# Altium schematic sheet STM32_BalanceCar.SchDoc
size A2
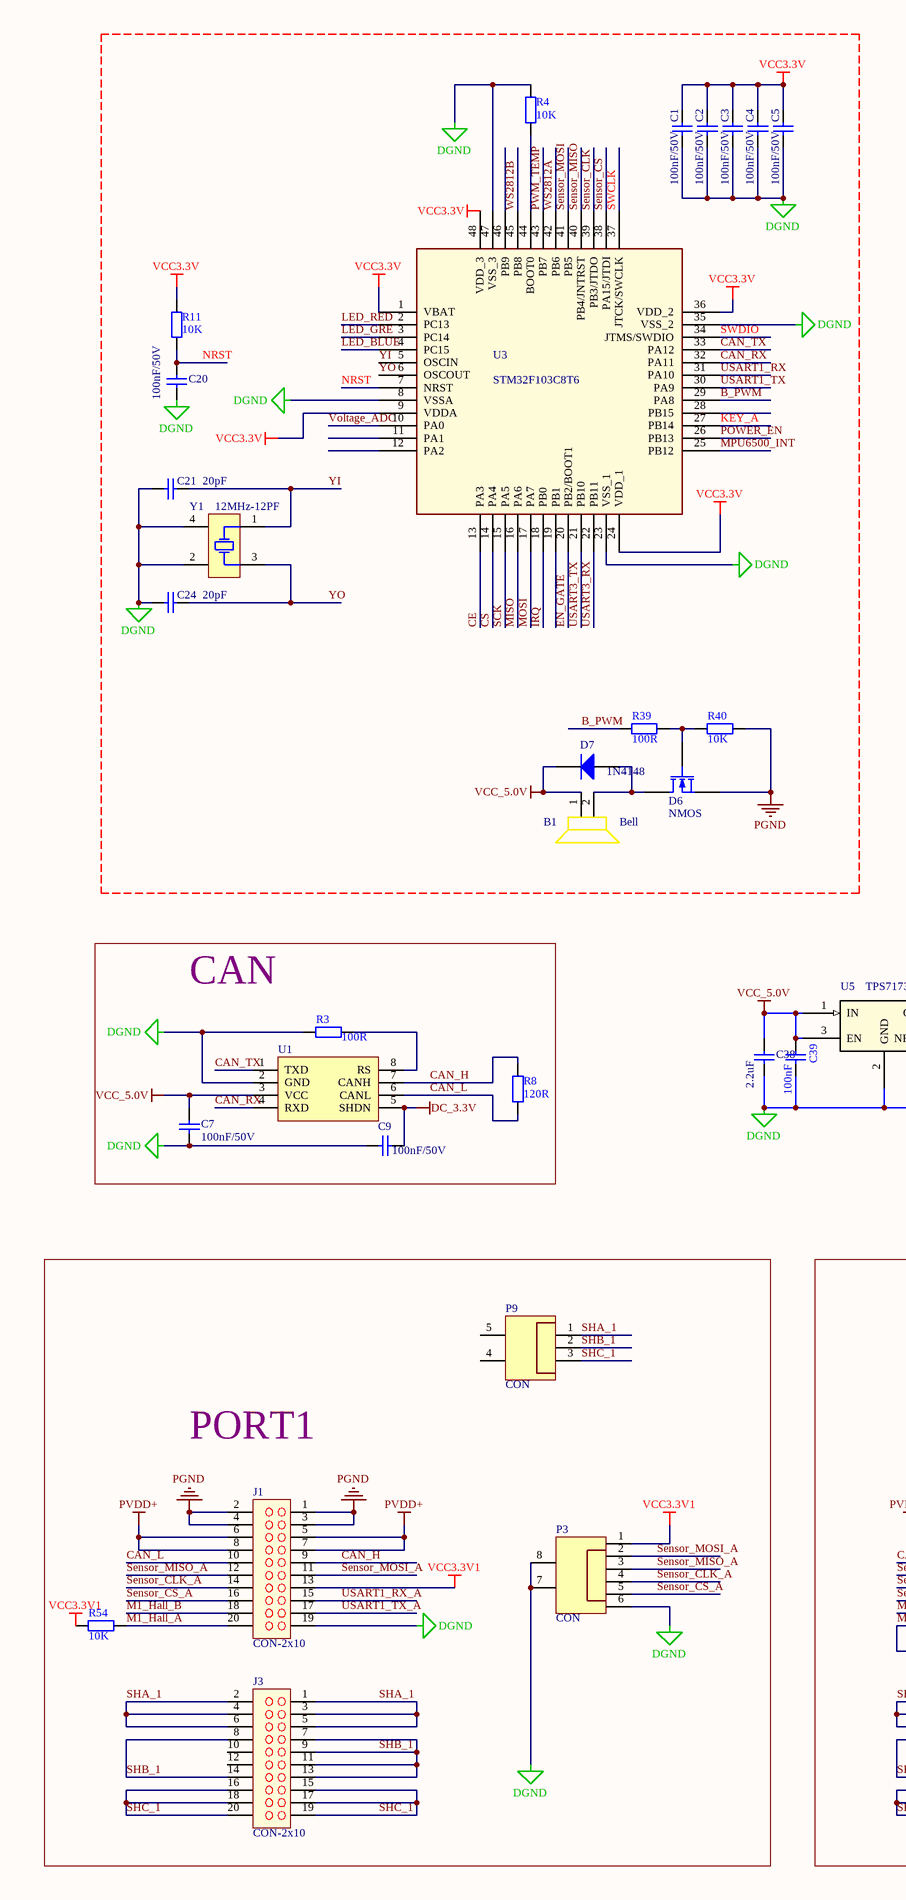
[diagram p0: STM32_BalanceCar.SchDoc, left]
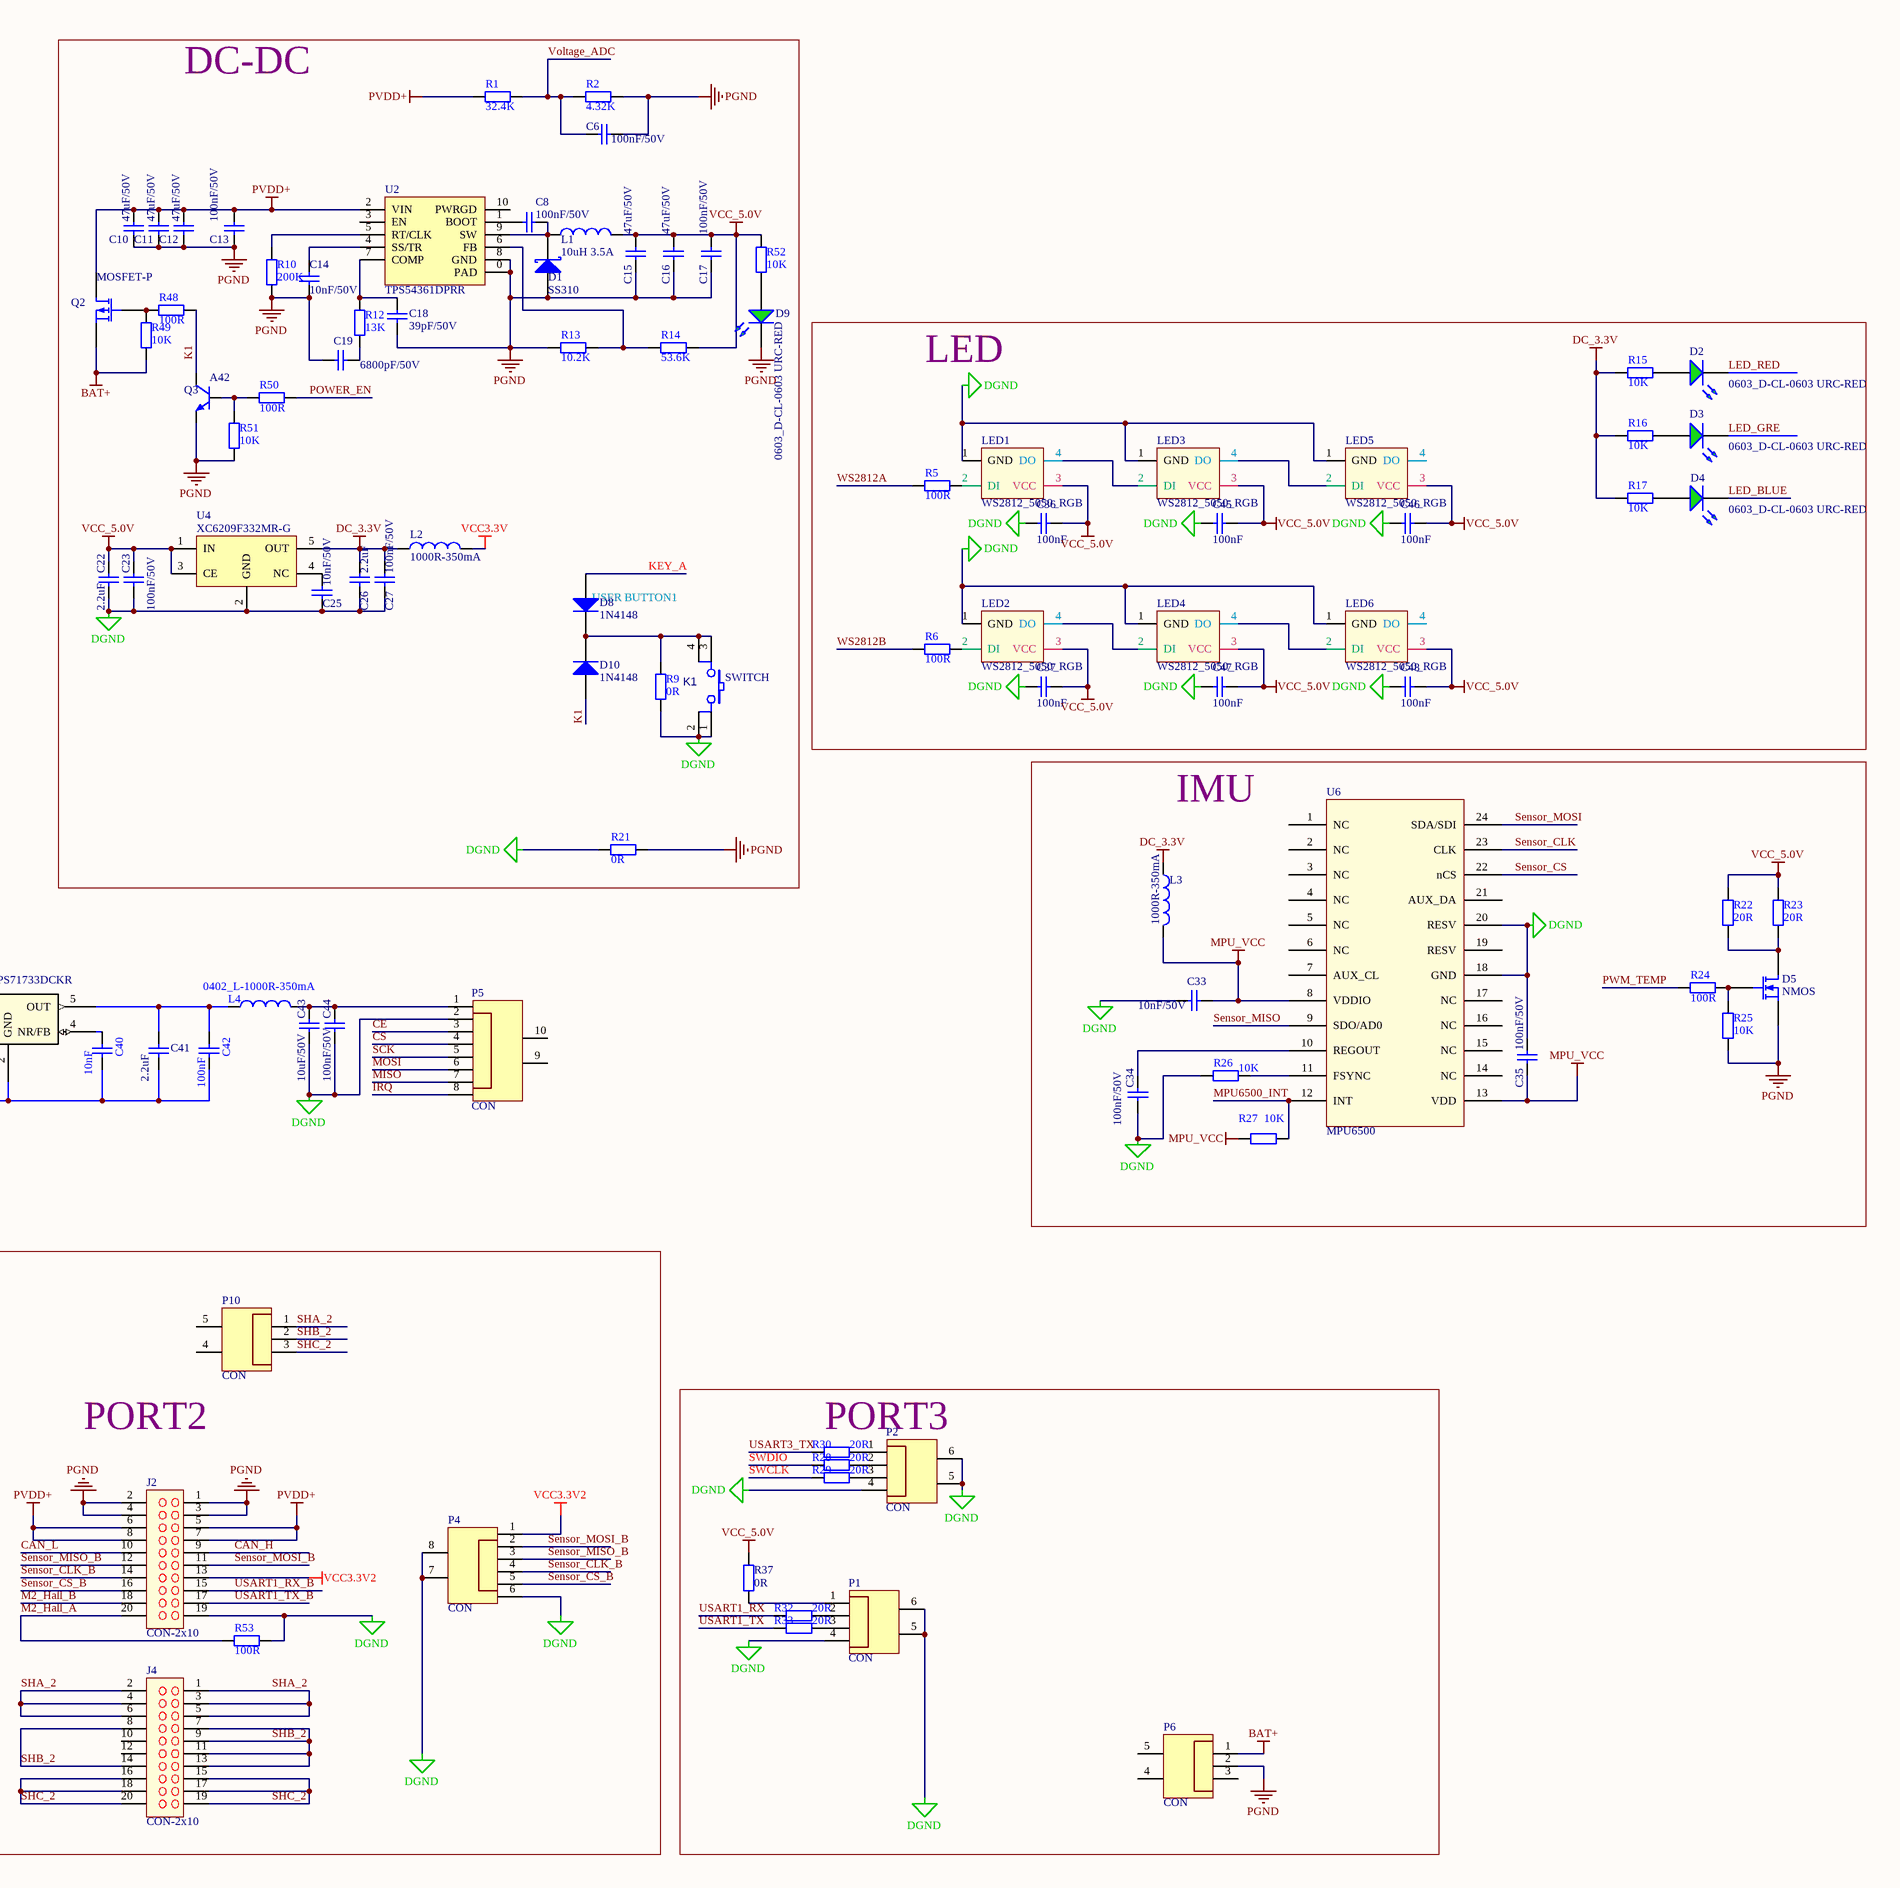
[diagram p1: STM32_BalanceCar.SchDoc, right]

## Parts
B1  Bell  [Bell]
C1  100nF/50V  [0402_C]
C2  100nF/50V  [0402_C]
C3  100nF/50V  [0402_C]
C4  100nF/50V  [0402_C]
C5  100nF/50V  [0402_C]
C6  100nF/50V  [0402_C]
C7  100nF/50V  [0402_C]
C8  100nF/50V  [0402_C]
C9  100nF/50V  [0402_C]
C10  47uF/50V  [1210_C]
C11  47uF/50V  [1210_C]
C12  47uF/50V  [1210_C]
C13  100nF/50V  [0402_C]
C14  10nF/50V  [0402_C]
C15  47uF/50V  [1206_C]
C16  47uF/50V  [1206_C]
C17  100nF/50V  [0402_C]
C18  39pF/50V  [0402_C]
C19  6800pF/50V  [0402_C]
C20  100nF/50V  [0402_C]
C21  20pF  [0402_C]
C22  2.2uF  [0402_C]
C23  100nF/50V  [0402_C]
C24  20pF  [0402_C]
C25  10nF/50V  [0402_C]
C26  2.2uF  [0402_C]
C27  100nF/50V  [0402_C]
C33  10nF/50V  [0402_C]
C34  100nF/50V  [0402_C]
C35  100nF/50V  [0402_C]
C36  100nF  [0402_C]
C37  100nF  [0402_C]
C38  2.2uF  [0603_C]
C39  100nF  [0402_C]
C40  10nF  [0402_C]
C41  2.2uF  [0603_C]
C42  100nF  [0402_C]
C43  10uF/50V  [0603_C]
C44  100nF/50V  [0603_C]
C45  100nF  [0402_C]
C46  100nF  [0402_C]
C47  100nF  [0402_C]
C48  100nF  [0402_C]
D1  SS310  [DO-214-AC(SMA)]
D2  0603_D-CL-0603 URC-RED  [0603_D]
D3  0603_D-CL-0603 URC-RED  [0603_D]
D4  0603_D-CL-0603 URC-RED  [0603_D]
D5  NMOS  [SOT23-3]
D6  NMOS  [SOT23-3]
D7  1N4148  [SOD-123]
D8  1N4148  [SOD-123]
D9  0603_D-CL-0603 URC-RED  [0603_D]
D10  1N4148  [SOD-123]
J1  CON-2x10  [CON-2x10]
J2  CON-2x10  [CON-2x10]
J3  CON-2x10  [CON-2x10]
J4  CON-2x10  [CON-2x10]
K1  value SWITCH  [SW_3x4x2.5]  (hidden comment: SW-PUSH-CMS)
L1  10uH 3.5A  [TMPC0603H]
L2  1000R-350mA  [0402_L]
L3  1000R-350mA  [0402_L]
L4  0402_L-1000R-350mA  [0402_L]
LED1  WS2812_5050_RGB  [RGB_50X50]
LED2  WS2812_5050_RGB  [RGB_50X50]
LED3  WS2812_5050_RGB  [RGB_50X50]
LED4  WS2812_5050_RGB  [RGB_50X50]
LED5  WS2812_5050_RGB  [RGB_50X50]
LED6  WS2812_5050_RGB  [RGB_50X50]
P1  CON  [BM04B-GHS-TBT(TOP)]
P2  CON  [BM04B-GHS-TBT(TOP)]
P3  CON  [BM06B-GHS-TBT(TOP)]
P4  CON  [BM06B-GHS-TBT(TOP)]
P5  CON  [NRF24L01_L]
P6  CON  [XT30U-F]
P9  CON  [MR30PW-FB]
P10  CON  [MR30PW-FB]
Q2  MOSFET-P  [DFN5X6]
Q3  A42  [SOT23-3]
R1  32.4K  [0402_R]
R2  4.32K  [0402_R]
R3  100R  [0402_R]
R4  10K  [0402_R]
R5  100R  [0402_R]
R6  100R  [0402_R]
R8  120R  [0603_R]
R9  0R  [0402_R]
R10  200K  [0402_R]
R11  10K  [0402_R]
R12  13K  [0402_R]
R13  10.2K  [0402_R]
R14  53.6K  [0402_R]
R15  10K  [0402_R]
R16  10K  [0402_R]
R17  10K  [0402_R]
R21  0R  [0805_R]
R22  20R  [0805_R]
R23  20R  [0805_R]
R24  100R  [0402_R]
R25  10K  [0402_R]
R26  10K  [0402_R]
R27  10K  [0402_R]
R28  20R  [0402_R]
R29  20R  [0402_R]
R30  20R  [0402_R]
R32  20R  [0402_R]
R33  20R  [0402_R]
R37  0R  [0603_R]
R39  100R  [0402_R]
R40  10K  [0402_R]
R48  100R  [0402_R]
R49  10K  [0402_R]
R50  100R  [0402_R]
R51  10K  [0402_R]
R52  10K  [0402_R]
R53  100R  [0402_R]
R54  10K  [0402_R]
U1  1042  [SOP-8]  (value not drawn)
U2  TPS54361DPRR  [TPS54361]
U3  STM32F103C8T6  [LQFP-48]
U4  XC6209F332MR-G  [SOT23-5]
U5  TPS71733DCKR  [SOT23-5]
U6  MPU6500  [MPU6500]
Y1  12MHz-12PF  [XTAL_SMD_3.2X2.5_4P]

## Blocks framed on the sheet
DC-DC: C6 C8 C10-C19 C22 C23 C25-C27 D1 D8-D10 K1 L1 L2 Q2 Q3 R1 R2 R9 R10 R12-R14 R21 R48-R52 U2 U4
LED: C36 C37 C45-C48 D2-D4 LED1-LED6 R5 R6 R15-R17
IMU: C33-C35 D5 L3 R22-R27 U6
CAN: C7 C9 R3 R8 U1
PORT1: J1 J3 P3 P9 R54
PORT2: J2 J4 P4 P10 R53
PORT3: P1 P2 P6 R28-R30 R32 R33 R37

## Nets
BAT+: P6.1 Q2.3(S) R49.2
DC_3.3V: C9.2 C26.1 C27.1 L2.1 L3.1 R15.2 R16.2 R17.2 U1.5(SHDN) U4.5(OUT)
DGND: C1.2 C2.2 C3.2 C4.2 C5.1 C7.2 C9.1 C20.2 C21.2 C22.2 C23.2 C24.2 C25.1 C26.2 C27.2 C33.2 C34.1 C35.2 C36.1 C37.1 C38.1 C39.1 C40.1 C41.1 C42.1 C43.1 C44.1 C45.1 C46.1 C47.2 C48.1 J1.19 J2.19 K1.1 K1.2 LED1.1(GND) LED2.1(GND) LED3.1(GND) LED4.1(GND) LED5.1(GND) LED6.1(GND) P1.4 P1.5 P1.6 P2.4 P2.5 P2.6 P3.6 P3.7 P3.8 P4.6 P4.7 P4.8 P5.2 R3.2 R4.1 R9.2 R21.1 R26.1 R53.1 U1.2(GND) U3.8(VSSA) U3.23(VSS_1) U3.35(VSS_2) U3.47(VSS_3) U4.2(GND) U5.2(GND) U6.18(GND) U6.20(RESV) Y1.2 Y1.4
MPU_VCC: C33.1 C35.1 L3.2 R27.1 U6.8(VDDIO) U6.13(VDD)
PGND: C6.1 C10.1 C11.1 C12.1 C13.1 C14.1 C15.1 C16.1 C17.1 C18.1 C19.1 D1.1(A) D5.2(D) D6.2(D) D9.2(K) J1.1 J1.2 J1.3 J1.4 J2.1 J2.2 J2.3 J2.4 P6.2 Q3.2(E) R2.2 R10.2 R13.1 R21.2 R25.1 R40.2 R51.2 U2.0(PAD) U2.8(GND)
PVDD+: C10.2 C11.2 C12.2 C13.2 J1.5 J1.6 J1.7 J1.8 J2.5 J2.6 J2.7 J2.8 Q2.2(D) R1.1 U2.2(VIN)
VCC3.3V: C1.1 C2.1 C3.1 C4.1 C5.2 L2.2 R11.1 U3.1(VBAT) U3.9(VDDA) U3.24(VDD_1) U3.36(VDD_2) U3.48(VDD_3)
VCC3.3V1: J1.13 P3.1 R54.1
VCC3.3V2: J2.13 P4.1
VCC_5.0V: B1.1(+) C7.1 C15.2 C16.2 C17.2 C22.1 C23.1 C36.2 C37.2 C38.2 C39.2 C45.2 C46.2 C47.1 C48.2 D7.2(K) L1.2 LED1.3(VCC) LED2.3(VCC) LED3.3(VCC) LED4.3(VCC) LED5.3(VCC) LED6.3(VCC) R14.2 R22.2 R23.2 R37.2 R52.1 U1.3(VCC) U4.1(IN) U4.3(CE) U5.1(IN) U5.3(EN)
B_PWM: R39.2 U3.29(PA8)
CAN_H: J1.9 J2.9 R8.1 U1.7(CANH)
CAN_L: J1.10 J2.10 R8.2 U1.6(CANL)
CAN_RX: U1.4(RXD) U3.32(PA11)
CAN_TX: U1.1(TXD) U3.33(PA12)
CE: P5.3 U3.13(PA3)
CS: P5.4 U3.14(PA4)
EN_GATE: U3.20(PB2/BOOT1)
IRQ: P5.8 U3.18(PB0)
K1: D10.1(A) Q3.3(C) R48.1
KEY_A: D8.1(A) U3.27(PB14)
LED_BLUE: D4.2(K) U3.4(PC15)
LED_GRE: D3.2(K) U3.3(PC14)
LED_RED: D2.2(K) U3.2(PC13)
M1_Hall_A: J1.20 R54.2
M1_Hall_B: J1.18
M2_Hall_A: J2.20 R53.2
M2_Hall_B: J2.18
MISO: P5.7 U3.16(PA6)
MOSI: P5.6 U3.17(PA7)
MPU6500_INT: R27.2 U3.25(PB12) U6.12(INT)
NRST: C20.1 R11.2 U3.7(NRST)
POWER_EN: R50.1 U3.26(PB13)
PWM_TEMP: R24.2 U3.43(PB7)
SCK: P5.5 U3.15(PA5)
Sensor_CLK: U3.39(PB3/JTDO) U6.23(CLK)
Sensor_CLK_A: J1.14 P3.4
Sensor_CLK_B: J2.14 P4.4
Sensor_CS: U3.38(PA15/JTDI) U6.22(nCS)
Sensor_CS_A: J1.16 P3.5
Sensor_CS_B: J2.16 P4.5
Sensor_MISO: U3.40(PB4/JNTRST) U6.9(SDO/AD0)
Sensor_MISO_A: J1.12 P3.3
Sensor_MISO_B: J2.12 P4.3
Sensor_MOSI: U3.41(PB5) U6.24(SDA/SDI)
Sensor_MOSI_A: J1.11 P3.2
Sensor_MOSI_B: J2.11 P4.2
SHA_1: J3.1 J3.2 J3.3 J3.4 J3.5 J3.6 P9.1
SHA_2: J4.1 J4.2 J4.3 J4.4 J4.5 J4.6 P10.1
SHB_1: J3.7 J3.8 J3.9 J3.11 J3.13 J3.14 P9.2
SHB_2: J4.7 J4.8 J4.9 J4.11 J4.13 J4.14 P10.2
SHC_1: J3.15 J3.16 J3.17 J3.18 J3.19 J3.20 P9.3
SHC_2: J4.15 J4.16 J4.17 J4.18 J4.19 J4.20 P10.3
SWCLK: R29.1 U3.37(JTCK/SWCLK)
SWDIO: R28.1 U3.34(JTMS/SWDIO)
USART1_RX: R32.1 U3.31(PA10)
USART1_RX_A: J1.15
USART1_RX_B: J2.15
USART1_TX: R33.1 U3.30(PA9)
USART1_TX_A: J1.17
USART1_TX_B: J2.17
USART3_RX: U3.22(PB11)
USART3_TX: R30.2 U3.21(PB10)
Voltage_ADC: C6.2 R1.2 R2.1 U3.10(PA0)
WS2812A: R5.1 U3.42(PB6)
WS2812B: R6.2 U3.45(PB8)
YI: C21.1 U3.5(OSCIN) Y1.1
YO: C24.1 U3.6(OSCOUT) Y1.3
NetB1_2: B1.2(-) D6.3(S) D7.1(A)
NetC8_1: C8.1 U2.1(BOOT)
NetC8_2: C8.2 D1.2(K) L1.1 U2.9(SW)
NetC14_2: C14.2 U2.4(SS/TR)
NetC18_2: C18.2 R12.1 U2.7(COMP)
NetC19_2: C19.2 R12.2
NetC25_2: C25.2 U4.4(NC)
NetC34_2: C34.2 U6.10(REGOUT)
NetC40_2: C40.2 U5.4(NR/FB)
NetC41_2: C41.2 C42.2 L4.1 U5.5(OUT)
NetC43_2: C43.2 C44.2 L4.2 P5.1
NetD2_1: D2.1(A) R15.1
NetD3_1: D3.1(A) R16.1
NetD4_1: D4.1(A) R17.1
NetD5_1: D5.1(G) R24.1 R25.2
NetD5_3: D5.3(S) R22.1 R23.1
NetD6_1: D6.1(G) R39.1 R40.1
NetD8_2: D8.2(K) D10.2(K) K1.3 K1.4 R9.1
NetD9_1: D9.1(A) R52.2
NetLED1_2: LED1.2(DI) R5.2
NetLED1_4: LED1.4(DO) LED3.2(DI)
NetLED2_2: LED2.2(DI) R6.1
NetLED2_4: LED2.4(DO) LED4.2(DI)
NetLED3_4: LED3.4(DO) LED5.2(DI)
NetLED4_4: LED4.4(DO) LED6.2(DI)
NetP1_1: P1.1 R37.1
NetP1_2: P1.2 R32.2
NetP1_3: P1.3 R33.2
NetP2_1: P2.1 R30.1
NetP2_2: P2.2 R28.2
NetP2_3: P2.3 R29.2
NetQ2_1: Q2.1(G) R48.2 R49.1
NetQ3_1: Q3.1(B) R50.2 R51.1
NetR3_1: R3.1 U1.8(RS)
NetR4_2: R4.2 U3.44(BOOT0)
NetR10_1: R10.1 U2.5(RT/CLK)
NetR13_2: R13.2 R14.1 U2.6(FB)
NetR26_2: R26.2 U6.11(FSYNC)

Not connected (* = marked no-connect by the designer): J3 10 12; J4 10 12; LED5 4(DO); LED6 4(DO); P5 9 10; P6 3 4 5; P9 4 5; P10 4 5; U2 3(EN) 10(PWRGD); U3 11(PA1) 12(PA2) 19(PB1) 28(PB15) 46(PB9); U6 1(NC) 2(NC) 3(NC) 4(NC) 5(NC) 6(NC) 7(AUX_CL) 14(NC) 15(NC) 16(NC) 17(NC) 19(RESV) 21(AUX_DA)

## Notes on the sheet
- (near D8) USER BUTTON1

## Library data of the parts
C1-C5 C7-C19 C25 C33-C39 C41-C48 = Cap: Capacitor; Published: 8-Jun-2000; LatestRevisionDate: 17-Jul-2002; LatestRevisionNote: Re-released for DXP Platform.; PackageReference: RAD-0.3; Publisher: Altium Limited
  C36 C37 C39 C42 C45-C48: Value: 100nF
C6 C20-C24 C26 C27 C40 = Cap: Capacitor; Value: 100nF; Published: 8-Jun-2000; LatestRevisionDate: 17-Jul-2002; LatestRevisionNote: Re-released for DXP Platform.; PackageReference: RAD-0.3; Publisher: Altium Limited
D1 = Diode Schottky: Published: 8-Jun-2000; LatestRevisionDate: 17-Jul-2002; LatestRevisionNote: Re-released for DXP Platform.; PackageReference: RAD-0.3; Publisher: Altium Limited
D2-D4 D9 = LED: value: BH-27-21/R6C-AP1Q2B/3C
D5 D6 = MOSFET: Published: 8-Jun-2000; LatestRevisionDate: 17-Jul-2002; LatestRevisionNote: Re-released for DXP Platform.; PackageReference: RAD-0.3; Publisher: Altium Limited
D7 D8 D10 = 1N4148: Diode; Published: 8-Jun-2000; LatestRevisionDate: 17-Jul-2002; LatestRevisionNote: Re-released for DXP Platform.; PackageReference: RAD-0.3; Publisher: Altium Limited
K1 = MCD-00002: Non-Open Push-Button 0.1A 24V; Manufacturer_Part_Number: TD-0341; Manufacturer: WEALTHMETAL; Part_Type: Misc; Provided_By: SUBCO; Internal_Part_Number: MCD-00002; ComponentLink1Description: Datasheet; Status: Released; ComponentLink1URL: http://tunmcdsvn.tun.st.com/Component_Datasheet_Library/Trunk/Misc/Wealthmetal_Tact-Switch_TD0341; ECCN_US: n/a; ECCN_EU: n/a
L1 L4 = Inductor: Code_IEC: 1005; Published: 8-Jun-2000; LatestRevisionDate: 17-Jul-2002; LatestRevisionNote: Re-released for DXP Platform.; PackageReference: 0402-A; Publisher: Altium Limited; Code_JEITA: 0402
L2 L3 = Inductor: Code_IEC: 1005; Value: BLM15AX102SN1; Published: 8-Jun-2000; LatestRevisionDate: 17-Jul-2002; LatestRevisionNote: Re-released for DXP Platform.; PackageReference: 0402-A; Publisher: Altium Limited; Code_JEITA: 0402
P1 P2 = CON-4
P3 P4 = CON-6
P5 = CON-8
P6 P9 P10 = CON-3
Q2 = MOSFET-P: P-Channel MOSFET
R1-R6 R8-R17 R21-R30 R32 R33 R39 R40 R48-R54 = Res2: Resistor; Value: 1K; Published: 8-Jun-2000; LatestRevisionDate: 17-Jul-2002; LatestRevisionNote: Re-released for DXP Platform.; PackageReference: AXIAL-0.4; Publisher: Altium Limited
R37 = Res: Resistor
U1 = MAX3051
U2 = TPS54361
U3 = STM32F103CBT6
U4 = XC6228D332VR-G
U5 = TPS71733DCKR: Imported; Manufacturer_Part_Number: tps71701_dck_5; GENERIC_PART_NUMBER: TPS71701; Vendor: Texas Instruments; PACKAGE_DESIGNATOR: DCK; PIN_COUNT: 5; FAMILY_NAME: SINGLE CHANNEL LDO; INDUSTRY_STD_PKG_TYPE: SC70; Manufacturer: Texas Instruments; Datasheet_URL: http://www.ti.com/lit/gpn/TPS71701; Value: Value; Type: Type; RefDes: RefDes
Y1 = XTAL-4P